# EAGLE design quadrature_generator (EAGLE 8.5.2)
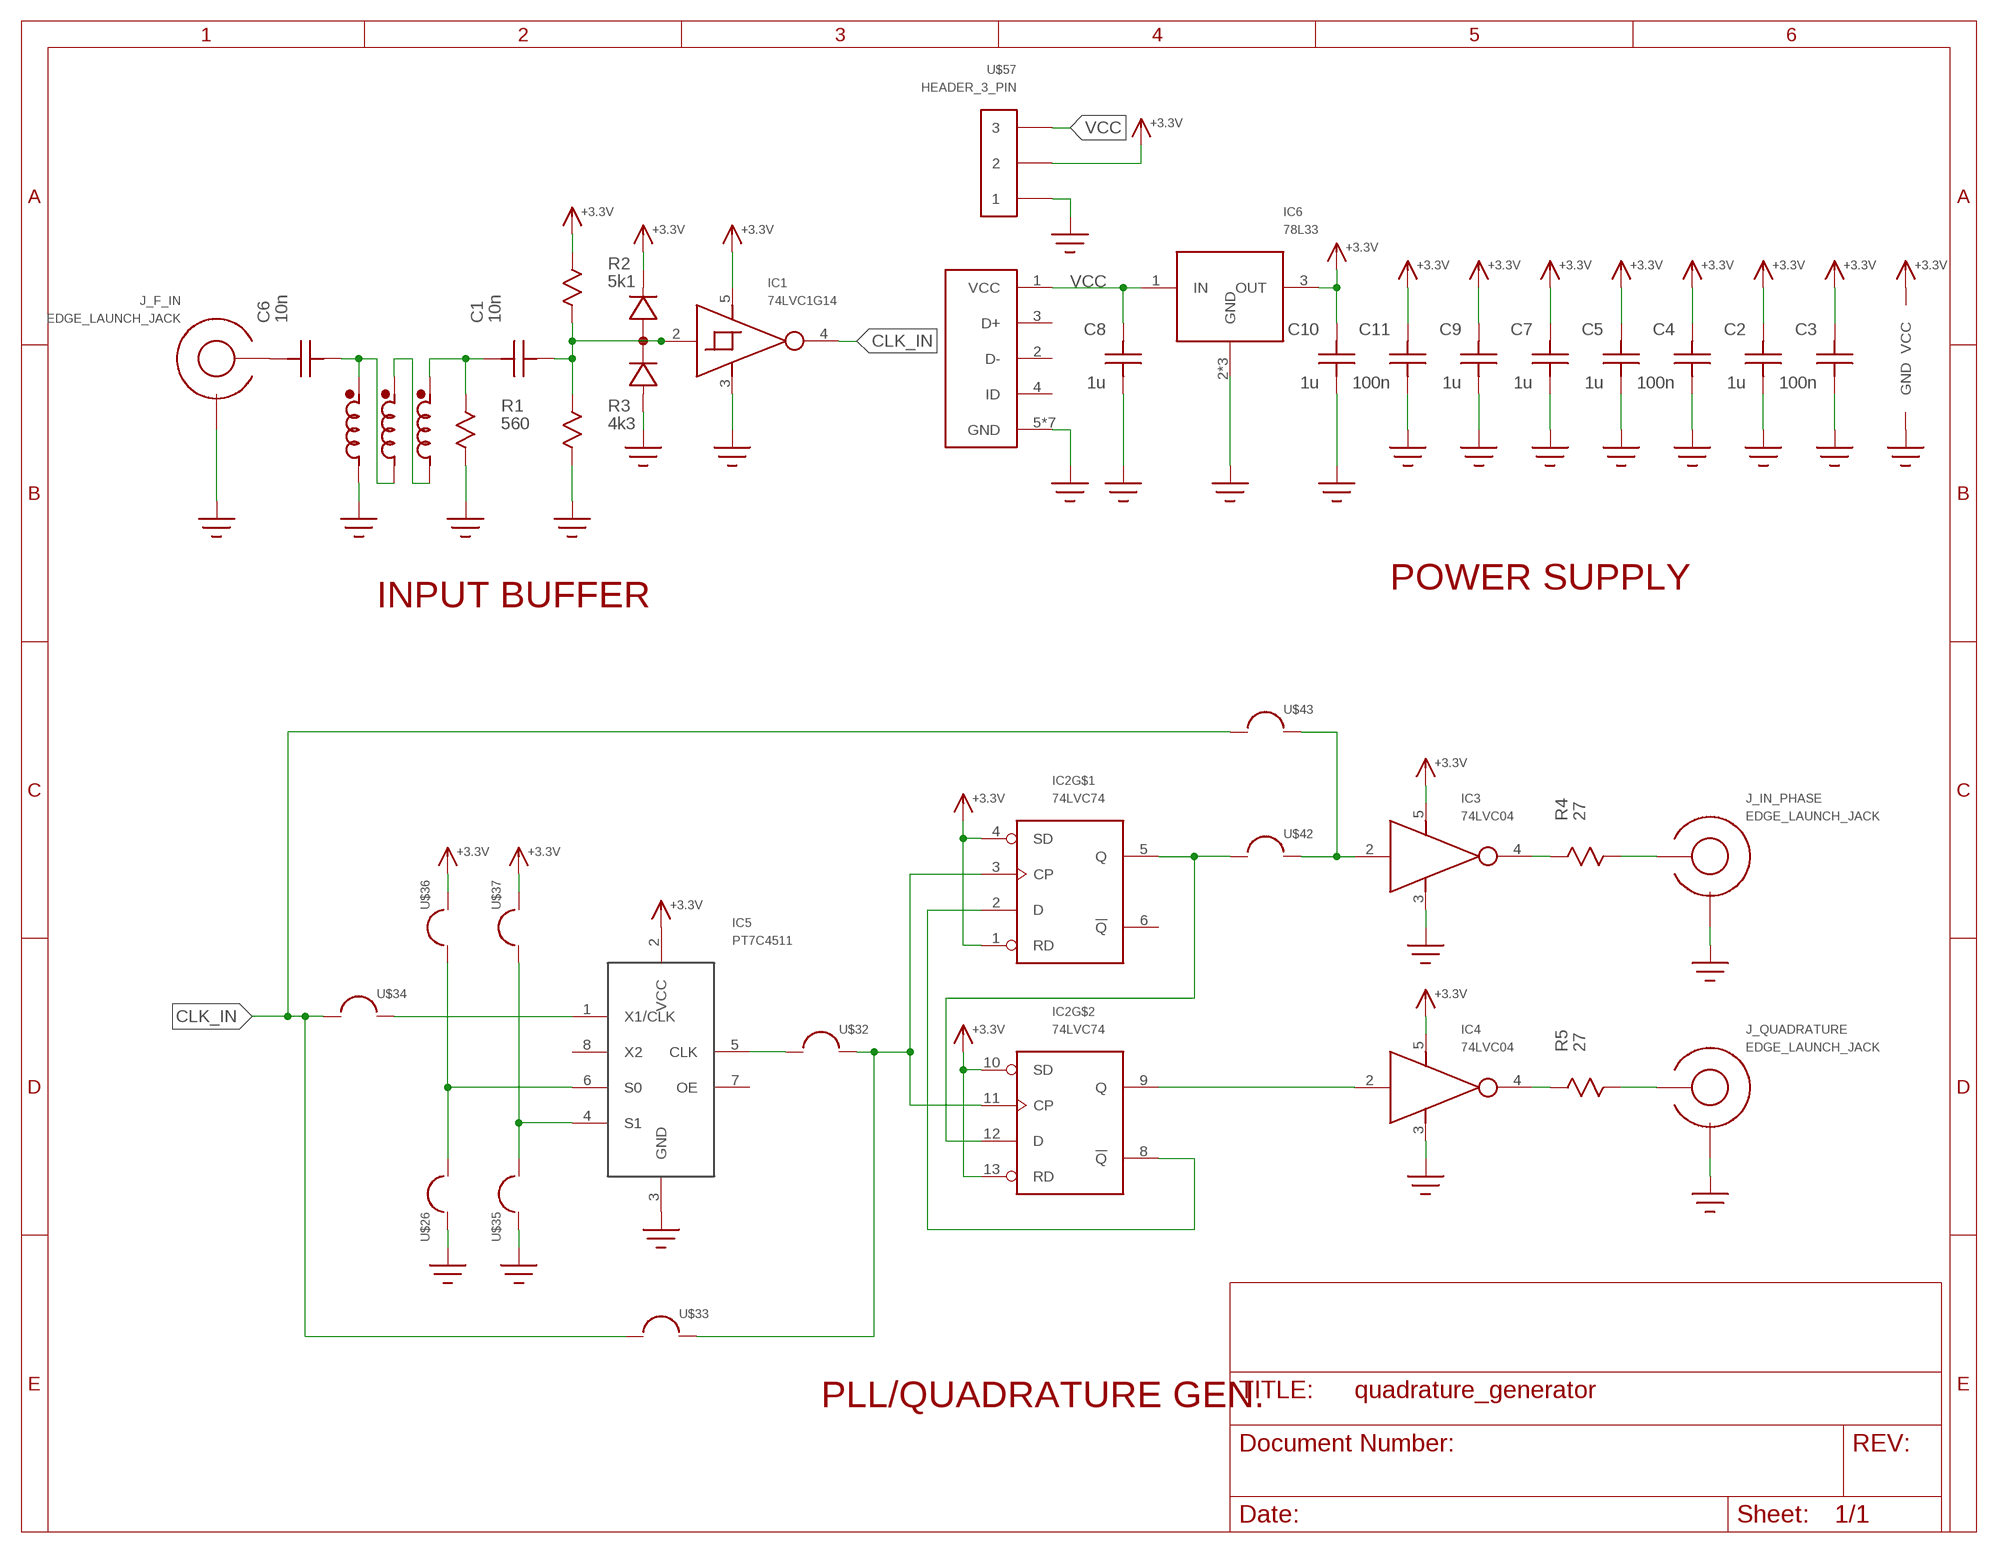
[diagram p0: schematic, sheet 1]

## Parts
C1  10n  C0805  [0805]
C2  1u  C0805  [0805]
C3  100n  C0805  [0805]
C4  100n  C0805  [0805]
C5  1u  C0805  [0805]
C6  10n  C0805  [0805]
C7  1u  C0805  [0805]
C8  1u  C0805  [0805]
C9  1u  C0805  [0805]
C10  1u  C0805  [0805]
C11  100n  C0805  [0805]
IC1  74LVC1G14  [SOT23-5]
IC2  74LVC74  [SOIC14_NARROW]
IC3  74LVC04  [SOT23-5]
IC4  74LVC04  [SOT23-5]
IC5  PT7C4511  [SOIC8]
IC6  78L33  REGULATOR_3TERM  [SOT-89]
J_F_IN  EDGE_LAUNCH_JACK  [EDGE_LAUNCH_RF_CON]
J_IN_PHASE  EDGE_LAUNCH_JACK  [EDGE_LAUNCH_RF_CON]
J_QUADRATURE  EDGE_LAUNCH_JACK  [EDGE_LAUNCH_RF_CON]
R1  560  R1206  [R1206]
R2  5k1  R0805  [R0805]
R3  4k3  R0805  [R0805]
R4  27  R1206  [R1206]
R5  27  R1206  [R1206]
U$1  FT37_TRIFILAR_1  [FT37_TRIFILAR_VERT_NC]
U$18  USB_JACK  [FCI_MICRO_USB]
U$26  SOLDER_BRIDGE  [SOLDER_BRIDGE]
U$32  SOLDER_BRIDGE  [SOLDER_BRIDGE]
U$33  SOLDER_BRIDGE  [SOLDER_BRIDGE]
U$34  SOLDER_BRIDGE  [SOLDER_BRIDGE]
U$35  SOLDER_BRIDGE  [SOLDER_BRIDGE]
U$36  SOLDER_BRIDGE  [SOLDER_BRIDGE]
U$37  SOLDER_BRIDGE  [SOLDER_BRIDGE]
U$42  SOLDER_BRIDGE  [SOLDER_BRIDGE]
U$43  SOLDER_BRIDGE  [SOLDER_BRIDGE]
U$50  MMBD7000L  [SOT-23]
U$57  HEADER_3_PIN  [HEADER_3_PIN]

## Nets
+3.3V: C2.P$1 C3.P$1 C4.P$1 C5.P$1 C7.P$1 C9.P$1 C10.P$1 C11.P$1 IC1.5(VCC) IC2.1(RD) IC2.4(SD) IC2.10(SD) IC2.13(RD) IC2.14(VCC) IC3.5(VCC) IC4.5(VCC) IC5.2(VCC) IC6.3(OUT) R2.P$1 U$36.2@1 U$36.2@2 U$36.2@3 U$37.2@1 U$37.2@2 U$37.2@3 U$50.2(CATHODE) U$57.2
CLK_IN: IC1.4(OUT) U$33.1 U$34.1 U$43.1
GND: C2.P$2 C3.P$2 C4.P$2 C5.P$2 C7.P$2 C8.P$2 C9.P$2 C10.P$2 C11.P$2 IC1.3(GND) IC2.7(GND) IC3.3(GND) IC4.3(GND) IC5.3(GND) IC6.2(GND) IC6.TAB(GND) IC6.TAB@1(GND) J_F_IN.GND@1(GND) J_F_IN.GND@2(GND) J_IN_PHASE.GND@1(GND) J_IN_PHASE.GND@2(GND) J_QUADRATURE.GND@1(GND) J_QUADRATURE.GND@2(GND) R1.P$2 R3.P$2 U$1.P$R1(R1) U$18.5(GND) U$18.GND1(GND) U$18.GND2(GND) U$18.GND3(GND) U$18.GND4(GND) U$18.GND5(GND) U$18.GND6(GND) U$26.2@1 U$26.2@2 U$26.2@3 U$35.2@1 U$35.2@2 U$35.2@3 U$50.1(ANODE) U$57.1
N$1: C6.P$1 U$1.P$G1(G1) U$1.P$R2(R2)
N$2: U$1.P$G2(G2) U$1.P$Y1(Y1)
N$3: C1.P$2 R1.P$1 U$1.P$Y2(Y2)
N$4: C1.P$1 IC1.2(IN) R2.P$2 R3.P$1 U$50.3(COMMON)
N$5: J_IN_PHASE.SIG R4.P$2
N$6: IC3.4(OUT) R4.P$1
N$7: IC2.5(Q) IC2.12(D) U$42.1
N$8: IC2.3(CP) IC2.11(CP) U$32.2@1 U$32.2@2 U$32.2@3 U$33.2@1 U$33.2@2 U$33.2@3
N$9: IC2.2(D) IC2.8(!Q!)
N$10: J_QUADRATURE.SIG R5.P$2
N$11: IC4.4(OUT) R5.P$1
N$12: IC2.9(Q) IC4.2(IN)
N$13: C6.P$2 J_F_IN.SIG
N$14: IC5.5(CLK) U$32.1
N$15: IC5.1(X1/CLK) U$34.2@1 U$34.2@2 U$34.2@3
N$19: IC3.2(IN) U$42.2@1 U$42.2@2 U$42.2@3 U$43.2@1 U$43.2@2 U$43.2@3
S0: IC5.6(S0) U$26.1 U$36.1
S1: IC5.4(S1) U$35.1 U$37.1
VCC: C8.P$1 IC6.1(IN) U$18.1(VCC) U$57.3
Unconnected: IC2.6(!Q!) IC5.7(OE) IC5.8(X2) U$18.2(D-) U$18.3(D+) U$18.4(ID)

## Notes on the sheet
- POWER SUPPLY
- INPUT BUFFER
- PLL/QUADRATURE GEN.

## Library data of the parts
C1-C11 = quadrature_generator:C
IC1 = quadrature_generator:74LVC1G14
IC2 = quadrature_generator:74LVC74
IC3 IC4 = quadrature_generator:74LVC04
IC5 = quadrature_generator:PT7C4511
IC6 = quadrature_generator:REGULATOR_3TERM
J_F_IN J_IN_PHASE J_QUADRATURE = quadrature_generator:EDGE_LAUNCH_JACK
R1-R5 = quadrature_generator:R
U$1 = quadrature_generator:FT37_TRIFILAR_1
U$18 = quadrature_generator:USB_JACK
U$26 U$32-U$37 U$42 U$43 = quadrature_generator:SOLDER_BRIDGE
U$50 = quadrature_generator:MMBD7000L
U$57 = quadrature_generator:HEADER_3_PIN

## Board
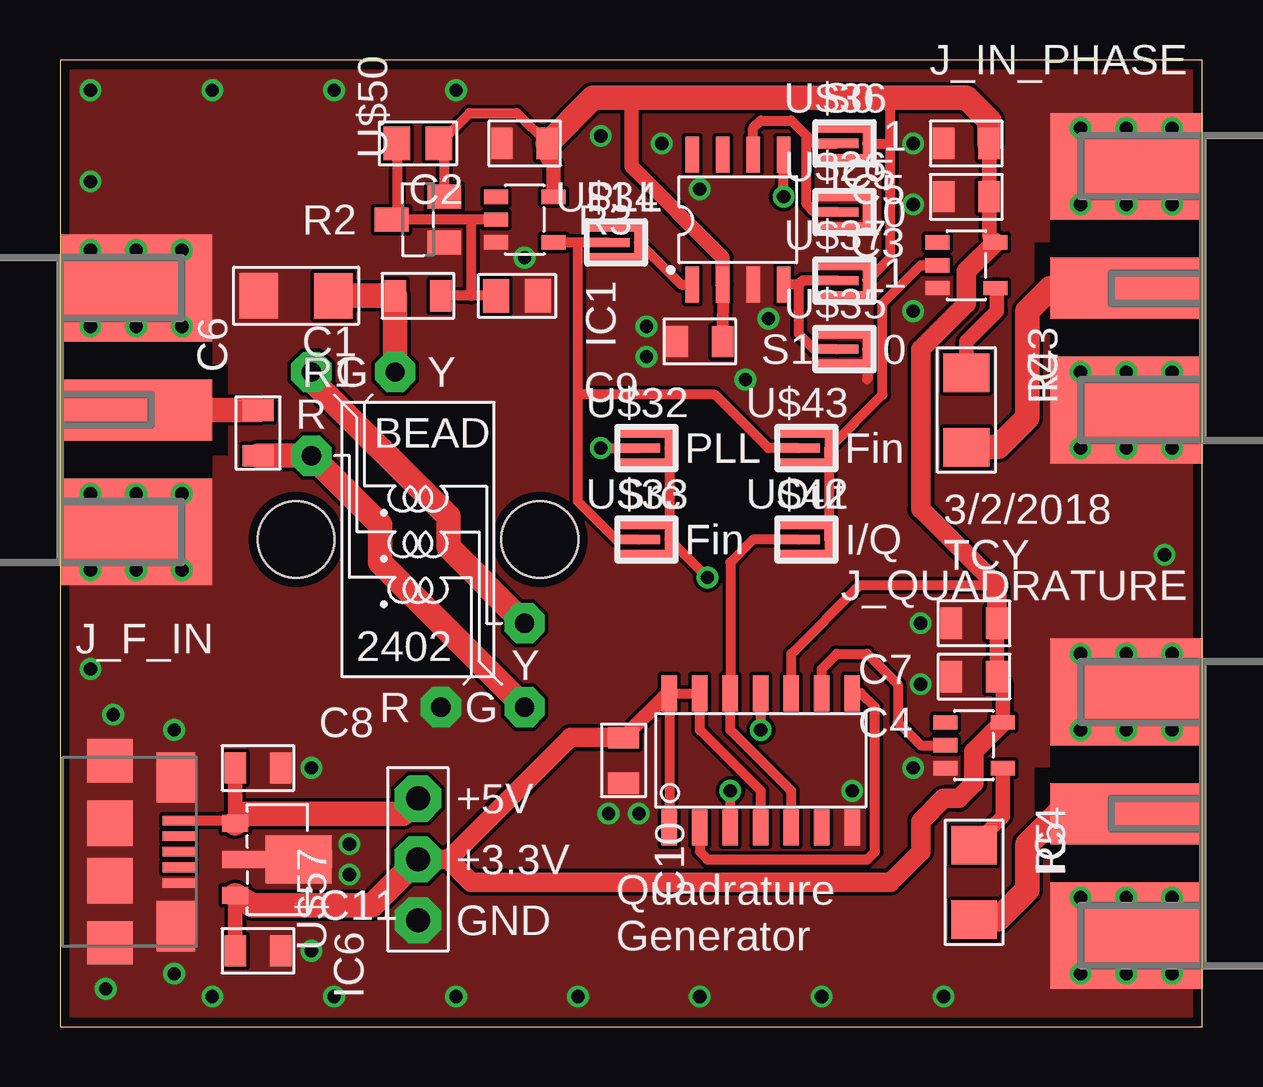
[diagram p1: board, top side]
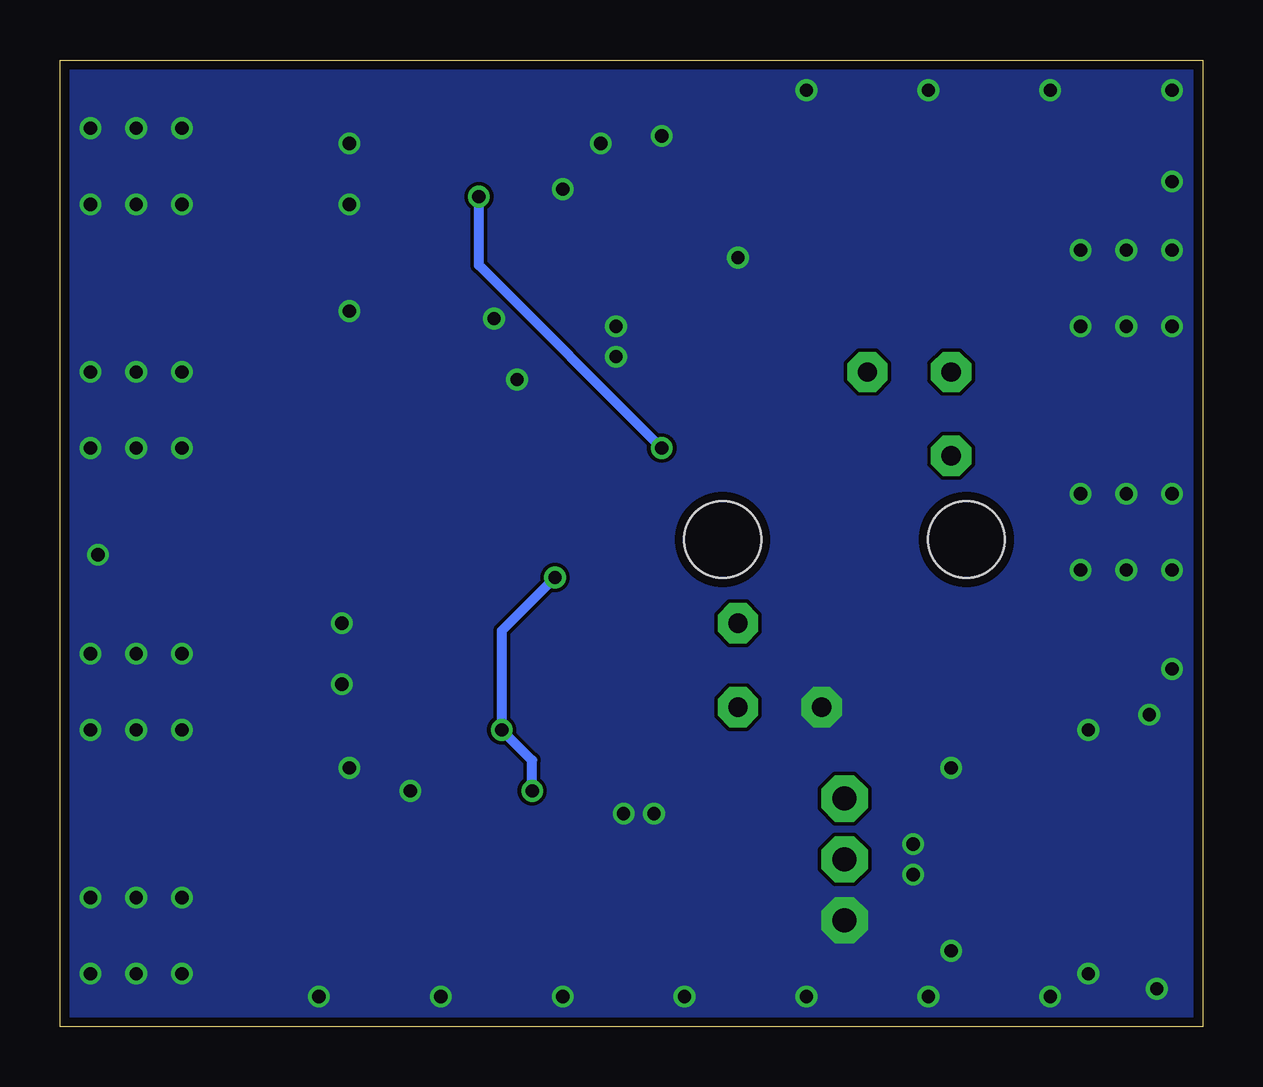
[diagram p2: board, bottom side, seen from below]

Size 47.6 x 40.31 mm. Coordinates in mm from the lower left corner, seen from the top.
Outline: 0,0 47.6,0 47.6,40.31 0,40.31 0,0
Copper layers (1*16): Top 0.0356mm / dielectric 1.5011mm / Bottom 0.0356mm
Design rules "LaenPCBOrder": minimum track width 6mil, minimum drill 13mil, track to track 6mil, track to pad 6mil, pad to pad 6mil, via to via 6mil, smd to smd 6mil, copper to edge 15mil, drill to drill 6mil, minimum pad ring 7mil, minimum via ring 7mil, stop-mask expansion 3mil, vias tented up to drill 0mil, thermal gap 10mil

### Footprints (pad centres in the part's own frame; a part is rotated, then mirrored left to right if it is on the bottom)
0805 = smd 0.9 x 1.3: P$1 -0.95,0; P$2 0.95,0
SOT23-5 = smd 0.6 x 1: 1 -0.95,-1.2; 2 0,-1.2; 3 0.95,-1.2; 4 0.95,1.2; 5 -0.95,1.2
SOIC14_NARROW = smd 0.65 x 1.5: 1 -3.81,-2.8; 2 -2.54,-2.8; 3 -1.27,-2.8; 4 0,-2.8; 5 1.27,-2.8; 6 2.54,-2.8; 7 3.81,-2.8; 8 3.81,2.8; 9 2.54,2.8; 10 1.27,2.8; 11 0,2.8; 12 -1.27,2.8; 13 -2.54,2.8; 14 -3.81,2.8
SOIC8 = smd 0.55 x 1.5: 1 -1.905,-2.7; 2 -0.635,-2.7; 3 0.635,-2.7; 4 1.905,-2.7; 5 1.905,2.7; 6 0.635,2.7; 7 -0.635,2.7; 8 -1.905,2.7
SOT-89 = smd 0.7 x 1.1: 1 -1.5,0; 2 0,0; 3 1.5,0 | smd 2 x 2.75: TAB 0,2.65 | smd 0.7 x 4.6: TAB@1 0,1.75
EDGE_LAUNCH_RF_CON = smd 4.445 x 6.35: GND@1 -5.08,0; GND@2 5.08,0 | smd 2.54 x 6.35: SIG 0,0
R1206 = smd 1.6 x 1.9: P$1 -1.55,0; P$2 1.55,0
R0805 = smd 1.1 x 1.4: P$1 -0.875,0; P$2 0.875,0
FT37_TRIFILAR_VERT_NC = drill 0.8 pad 1.676 octagon: P$G1 -4.445,6.985; P$G2 4.445,-6.985; P$R1 -0.953,6.985; P$R2 4.445,-3.493; P$Y1 -4.445,3.493; P$Y2 0.953,-6.985 | hole 3.2: -5.08,0; 5.08,0
FCI_MICRO_USB = smd 0.4 x 1.35: 1 -1.3,4.325; 2 -0.65,4.325; 3 0,4.325; 4 0.65,4.325; 5 1.3,4.325 | smd 1.8 x 1.9: GND1 -3.8,1.45; GND4 3.8,1.45 | smd 1.9 x 1.9: GND2 -1.2,1.45; GND3 1.2,1.45 | smd 2.1 x 1.6: GND5 -3.1,4.2; GND6 3.1,4.2
SOLDER_BRIDGE = smd 1.778 x 0.381: 1 0,0 | smd 0.381 x 1.27: 2@1 1.27,0 | smd 2.286 x 0.381: 2@2 0.318,0.635; 2@3 0.318,-0.635
SOT-23 = smd 1 x 1.4: 1 -0.95,-1.1; 2 0.95,-1.1; 3 0,1.1
HEADER_3_PIN = drill 1 pad 1.93 octagon: 1 -2.54,0; 2 0,0; 3 2.54,0

### Placement (x,y rotation side)
C1  14.92,30.48 180 top
C2  19.37,36.83 180 top
C3  37.78,34.61 180 top
C4  38.1,14.61 180 top
C5  37.78,36.83 180 top
C6  8.26,24.77 90 top
C7  38.1,16.83 180 top
C8  8.26,10.79 0 top
C9  26.67,28.57 180 top
C10  23.5,11.11 270 top
C11  8.26,3.17 0 top
IC1  19.37,33.66 270 top
IC2  29.21,11.11 0 top
IC3  37.78,31.75 270 top
IC4  38.1,11.75 270 top
IC5  28.26,33.66 0 top
IC6  7.3,6.99 270 top
J_F_IN  3.17,25.72 270 top
J_IN_PHASE  44.45,30.8 90 top
J_QUADRATURE  44.45,8.89 90 top
R1  9.84,30.48 180 top
R2  14.92,36.83 180 top
R3  19.05,30.48 0 top
R4  37.78,25.72 270 top
R5  38.1,6.03 270 top
U$1  14.92,20.32 180 top
U$18  0.64,7.3 270 top
U$26  32.38,33.97 0 top
U$32  24.13,24.13 0 top
U$33  24.13,20.32 0 top
U$34  22.86,32.7 0 top
U$35  32.38,28.26 0 top
U$36  32.38,36.83 0 top
U$37  32.38,31.11 0 top
U$42  30.8,20.32 0 top
U$43  30.8,24.13 0 top
U$50  14.92,33.66 90 top
U$57  14.92,6.99 90 top

### Tracks (layer width: path | path; a pad name or v marks a point on that pad's centre or on a via)
+3.3V
  Top 0.203: U$36.2@2 33.66,37.47 U$36.2@1 33.66,36.2 U$36.2@3 | U$37.2@2 33.66,31.75 U$37.2@1 33.66,30.48 U$37.2@3
  Top 0.406: U$50.2 16.02,36.83 R2.P$1 17.07,38.1 19.05,38.1 C2.P$1 | IC2.4 29.21,9.84 26.67,12.38 IC2.13 IC2.14 IC2.1 | U$37.2@1 34.61,32.07 34.61,36.83 | U$36.2@1 34.61,36.83 | 34.61,36.83 34.61,38.73 | IC2.10 30.48,15.56 33.34,18.42 39.05,18.42
  Top 0.508: IC5.2 C9.P$1
  Top 0.61: IC1.5 20.57,35.95 20.32,36.2 C2.P$1 | IC6.3 C11.P$1 | C10.P$1 25.34,13.91 IC2.14 | C7.P$1 C4.P$1 39.3,14.36 IC4.5 | C5.P$1 C3.P$1 38.73,32.95 IC3.5 | IC5.2 27.62,32.07 23.81,35.88 23.81,38.73
  Top 0.813: IC3.5 37.78,31.5 37.78,30.16 35.88,28.26 35.88,21.59 39.05,18.42 C7.P$1 | U$57.2 16.19,6.99 | 16.19,6.99 21.27,12.06 C10.P$1 | IC4.5 38.1,11.5 38.1,10.16 37.47,9.53 36.83,9.53 35.88,8.57 35.88,7.3 34.61,6.03 17.14,6.03 16.19,6.99
  Top 1.016: IC6.3 8.03,5.08 13.02,5.08 U$57.2 | C2.P$1 22.22,38.73 23.81,38.73 34.61,38.73 37.78,38.73 38.73,37.78 C5.P$1
CLK_IN
  Top 0.406: U$34.1 21.59,32.7 | 21.59,32.7 IC1.4 | 21.59,26.35 21.59,32.7 | 21.59,26.35 27.3,26.35 29.53,24.13 U$43.1 | U$33.1 23.18,20.32 21.59,21.91 21.59,26.35
GND  (via drill 0.55)
  Top 0.406: J_F_IN.GND@2 v3.17,19.05 | J_QUADRATURE.GND@2 v44.45,12.38 | J_QUADRATURE.GND@1 v44.45,2.22 | J_IN_PHASE.GND@2 v44.45,34.29 | J_IN_PHASE.GND@1 v44.45,24.13 | J_F_IN.GND@1 v3.17,29.21 | U$35.2@1 33.66,26.99
  other vias: 1.91,1.59 6.35,1.27 11.43,1.27 16.51,1.27 21.59,1.27 26.67,1.27 31.75,1.27 36.83,1.27 1.27,39.05 6.35,39.05 11.43,39.05 16.51,39.05 22.54,37.15 1.27,32.38 3.17,32.38 5.08,32.38 5.08,29.21 1.27,29.21 1.27,22.23 3.17,22.23 5.08,22.23 5.08,19.05 1.27,19.05 46.35,34.29 42.55,34.29 42.55,27.3 44.45,27.3 46.35,27.3 46.35,24.13 42.55,24.13 42.55,37.47 44.45,37.47 46.35,37.47 46.35,15.56 44.45,15.56 42.55,15.56 42.55,12.38 46.35,12.38 46.35,5.4 44.45,5.4 42.55,5.4 42.55,2.22 46.35,2.22 35.88,14.29 35.88,16.83 35.56,34.29 35.56,36.83 26.67,34.92 24.45,29.21 24.45,27.94 25.08,36.83 1.27,35.24 1.27,14.92 46.04,19.68 35.56,29.84 24.13,8.89 22.86,8.89 35.56,10.79 33.02,9.84 4.76,12.38 4.76,2.22 2.22,13.02 10.48,10.79 10.48,3.17 12.06,7.62 12.06,6.35 19.37,32.07 29.53,29.53 28.57,26.99
  pour Top (no thermals): 0,0 47.62,0 47.62,40.32 0,40.32
  pour Bottom (no thermals): 0,0 47.62,0 47.62,40.32 0,40.32
N$1
  Top 1.016: C6.P$1 U$1.P$R2 13.34,20.95 13.34,19.37 U$1.P$G1
N$2
  Top 1.016: U$1.P$G2 10.48,26.99 16.19,21.27 16.19,20 U$1.P$Y1
N$3
  Top 1.016: R1.P$1 C1.P$2 U$1.P$Y2
N$4
  Top 0.406: R2.P$2 14.05,33.88 U$50.3 IC1.2 17.14,33.66 17.14,30.48 | R3.P$1 17.14,30.48 | 17.14,30.48 C1.P$1
N$5
  Top 1.016: J_IN_PHASE.SIG 41.27,30.8 40.32,29.84 40.32,25.4 39.09,24.17 R4.P$2
N$6
  Top 0.61: R4.P$1 37.78,28.57 39.05,29.84 39.05,30.73 IC3.4
N$7
  Top 0.406: IC2.5 30.48,9.84 27.94,12.38 IC2.12 27.94,19.37 28.89,20.32 U$42.1
N$8  (via drill 0.55)
  Top 0.203: U$32.2@2 25.4,24.77 U$32.2@1 25.4,23.5 U$32.2@3 | U$33.2@2 25.4,20.95 U$33.2@1 25.4,19.68 U$33.2@3
  Top 0.406: IC2.3 v27.94,9.84 | v29.21,12.38 IC2.11 | v26.99,18.73 U$33.2@1 U$32.2@1
  Bottom 0.406: v27.94,9.84 27.94,11.11 v29.21,12.38 29.21,16.51 v26.99,18.73
N$9
  Top 0.406: IC2.2 26.67,7.3 26.99,6.99 33.66,6.99 33.97,7.3 33.97,13.34 33.4,13.91 IC2.8
N$10
  Top 1.016: J_QUADRATURE.SIG 41.59,8.89 40.32,7.62 40.32,5.71 39.09,4.48 R5.P$2
N$11
  Top 0.61: IC4.4 39.3,8.78 R5.P$1
N$12
  Top 0.406: IC2.9 31.75,14.92 32.38,15.56 33.66,15.56 34.92,14.29 34.92,12.7 35.88,11.75 IC4.2
N$13
  Top 1.016: J_F_IN.SIG C6.P$2
N$14  (via drill 0.55)
  Top 0.406: v30.16,34.61 IC5.5 | v22.54,24.13 U$32.1
  Bottom 0.406: v22.54,24.13 30.16,31.75 v30.16,34.61
N$15
  Top 0.203: U$34.2@2 24.13,33.34 U$34.2@1 24.13,32.07 U$34.2@3
  Top 0.406: U$34.2@1 25.88,30.95 IC5.1
N$19
  Top 0.203: U$43.2@2 32.07,24.77 U$43.2@1 32.07,23.5 U$43.2@3 | U$42.2@2 32.07,20.95 U$42.2@1 32.07,19.68 U$42.2@3
  Top 0.406: U$42.2@1 U$43.2@1 34.29,26.35 34.29,30.16 35.88,31.75 IC3.2
S0
  Top 0.406: IC5.6 28.89,37.47 29.21,37.78 30.48,37.78 31.11,37.15 | 31.11,37.15 31.43,36.83 U$36.1 | U$26.1 31.43,33.97 31.11,34.29 31.11,37.15
S1
  Top 0.406: 30.8,30.95 IC5.4 | U$37.1 30.96,31.11 30.8,30.95 | U$35.1 31.43,28.26 30.8,28.89 30.8,30.95
VCC
  Top 0.406: U$18.1 7.18,8.6 IC6.1
  Top 0.61: IC6.1 C8.P$1
  Top 1.016: IC6.1 7.71,8.89 14.29,8.89 U$57.3

### Text on the board
tPlace: S0 | 1 | PLL | 0 | 1 | S1 | 0 | PLL | Fin | Src | Out | 3/2/2018 | Fin | I/Q | TCY | +5V | +3.3V | Quadrature | GND | Generator